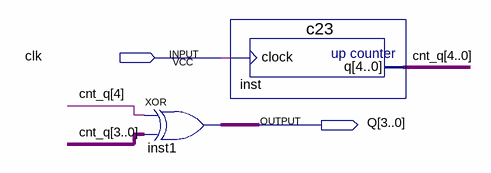
[diagram p0: schematic sheet]
// Quartus schematic p4.bdf as structural Verilog: 2 symbols, 2 pins
module p4 (
  input  clk,
  output [3:0] Q
);

  wire [4:0] cnt_q;

  assign Q = {4{cnt_q[4]}} ^ cnt_q[3:0];  // XOR inst1, 4 bits wide
  c23 inst (.clock(clk), .q(cnt_q));
endmodule
